# Altium project MGMEZZ04.PrjPCB (part 2 of 3)

## Sheet BuckReg.SchDoc
size Letter; Author: Adam Gilbert; CompanyName: McGill University; DrawnBy: Adam Gilbert; Organization: Altium Limited; Address1: McGill Cosmology; Address2: 3600 University Street; Address3: Montreal, Quebec; Address4: Canada; DocumentNumber: 3; Revision: Rev2; SheetNumber: 3; SheetTotal: 16; ProjectTitle: DfMux FMC Mezz; ModelNumber: MGMEZZ04; ProjectName: DfMux FMC Mezz
Used 2 times, as channels U_FMCPower/BP, U_FMCPower/BN. Parts and nets are listed once, with the designators drawn on the sheet.
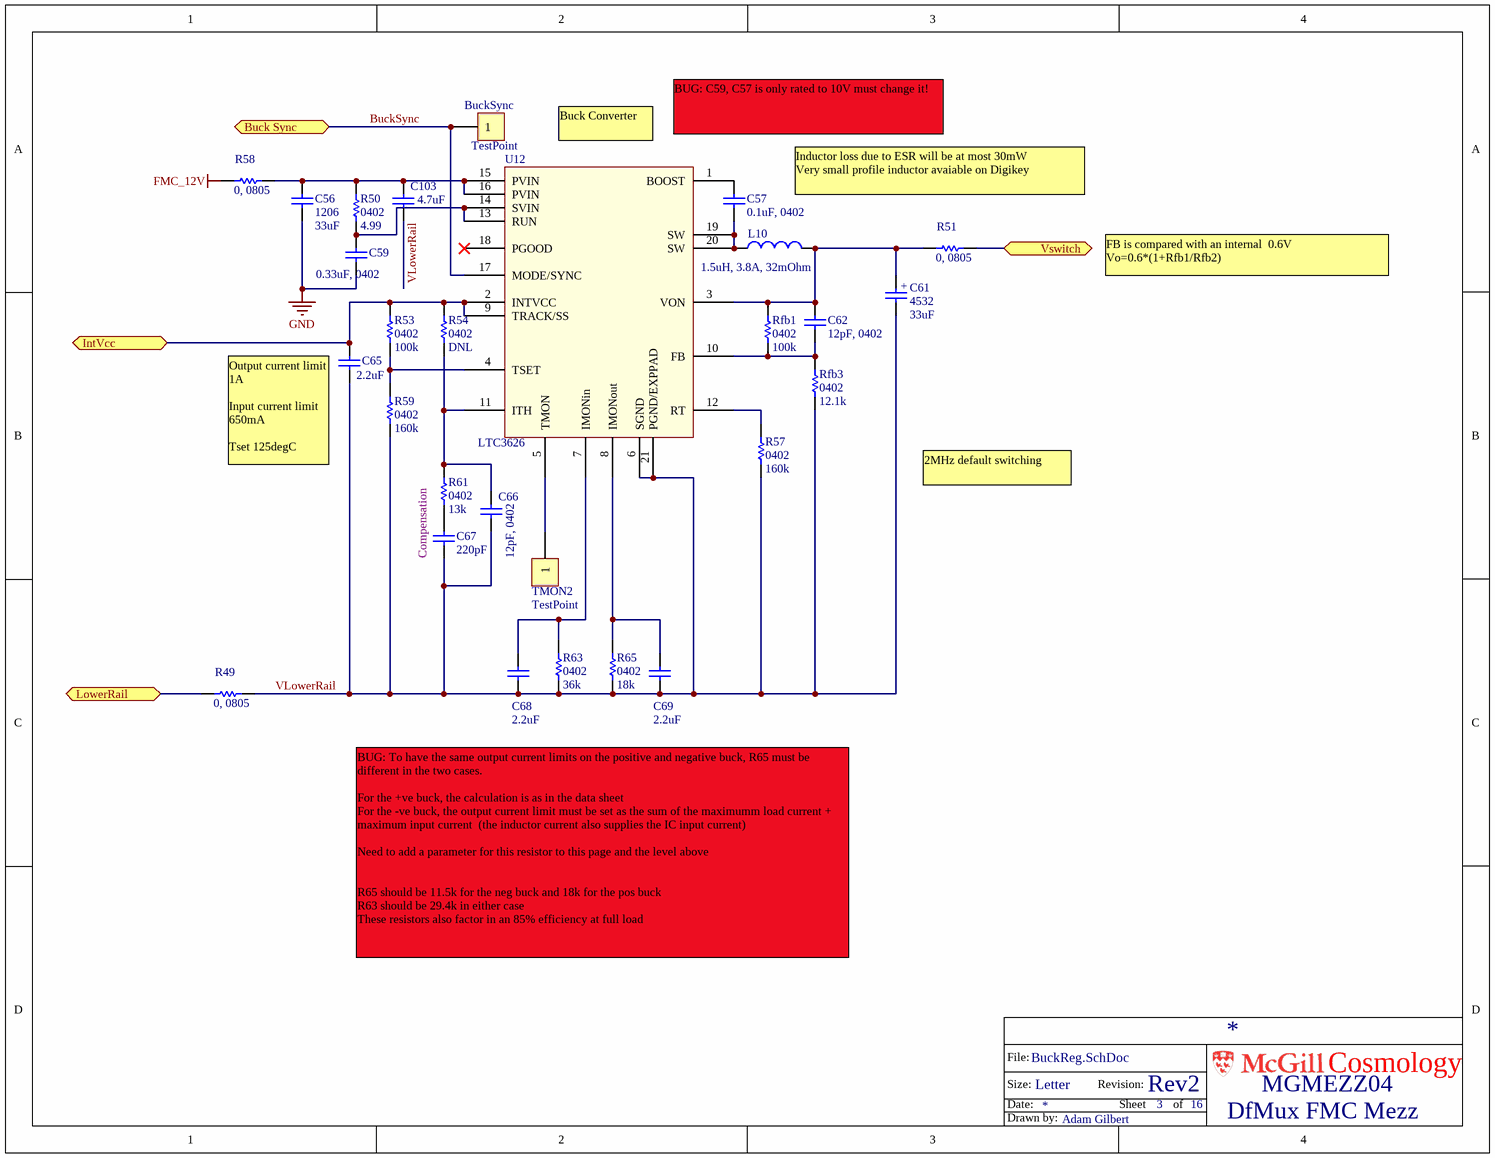
[diagram p6: BuckReg.SchDoc]

### Parts
BuckSync  TestPoint  [TP-3520-SK]  (no BOM)
C56  Footprint: 1206  [CC3225-1210]  (hidden comment: 33uF)
C57  0.1uF, 0402  [0402]
C59  0.33uF, 0402  [0402]
C61  Footprint: 4532  [TANT4532]  (hidden comment: 33uF)
C62  12pF, 0402  [0402]
C65  2.2uF  [0603]
C66  12pF, 0402  [0402]
C67  220pF  [0603]
C68  2.2uF  [0603]
C69  2.2uF  [0603]
C103  4.7uF  [0603]
L10  Part Constraints: 1.5uH, 3.8A, 32mOhm  [IHLP-1212]  (hidden comment: 1.5uH)
R49  0, 0805  [0805]
R50  4.99  [0402]
R51  0, 0805  [0805]
R53  100k  [0402]
R54  DNL  [0402]
R57  160k  [0402]
R58  0, 0805  [0805]
R59  160k  [0402]
R61  13k  [0402]
R63  36k  [0402]
R65  18k  [0402]
Rfb1  100k  [0402]
Rfb3  12.1k  [0402]
TMON2  TestPoint  [TP-3520-SK]  (no BOM)
U12  LTC3626  [LTC3626]

### Ports
Buck Sync, IntVcc, LowerRail, Vswitch

### Nets
FMC_12V: R58.2
GND: C56.2 C59.1
BuckSync: BuckSync.1 U12.17(MODE/SYNC) ; port Buck Sync
IntVcc: C65.2 R53.1 R54.1 U12.2(INTVCC) U12.9(TRACK/SS) ; port IntVcc
LowerRail: R49.2 ; port LowerRail
VLowerRail: C61.2 C65.1 C66.1 C67.2 C68.2 C69.2 C103.2 R49.1 R57.2 R59.2 R63.2 R65.2 Rfb3.2 U12.6(SGND) U12.21(PGND/EXPPAD)
Vswitch: R51.1 ; port Vswitch
NetC56_1: C56.1 C103.1 R50.1 R58.1 U12.15(PVIN) U12.16(PVIN)
NetC57_1: C57.1 L10.1 U12.19(SW) U12.20(SW)
NetC57_2: C57.2 U12.1(BOOST)
NetC59_2: C59.2 R50.2 U12.13(RUN) U12.14(SVIN)
NetC61_1: C61.1 C62.2 L10.2 R51.2 Rfb1.1 U12.3(VON)
NetC62_1: C62.1 Rfb1.2 Rfb3.1 U12.10(FB)
NetC66_2: C66.2 R54.2 R61.1 U12.11(ITH)
NetC67_1: C67.1 R61.2
NetC68_1: C68.1 R63.1 U12.7(IMONin)
NetC69_1: C69.1 R65.1 U12.8(IMONout)
NetR53_2: R53.2 R59.1 U12.4(TSET)
NetR57_1: R57.1 U12.12(RT)
NetTMON2_1: TMON2.1 U12.5(TMON)

Not connected (* = marked no-connect by the designer): U12 18(PGOOD)*

### Channels
U_FMCPower/BP: designators BuckSync=BuckSyncB C56=C56B C57=C57B C59=C59B C61=C61B C62=C62B C65=C65B C66=C66B C67=C67B C68=C68B C69=C69B C103=C103A L10=L10B R49=R49B R50=R50B R51=R51B R53=R53B R54=R54B R57=R57B R58=R58B R59=R59B R61=R61B R63=R63B R65=R65B Rfb1=Rfb1B Rfb3=Rfb3B TMON2=TMON2B U12=U12B; ports Buck Sync=BuckSync IntVcc=NetC65B_2 LowerRail=GND Vswitch=P5V5int
U_FMCPower/BN: designators BuckSync=BuckSyncA C56=C56A C57=C57A C59=C59A C61=C61A C62=C62A C65=C65A C66=C66A C67=C67A C68=C68A C69=C69A C103=C103B L10=L10A R49=R49A R50=R50A R51=R51A R53=R53A R54=R54A R57=R57A R58=R58A R59=R59A R61=R61A R63=R63A R65=R65A Rfb1=Rfb1A Rfb3=Rfb3A TMON2=TMON2A U12=U12A; ports Buck Sync=BuckSyncInv IntVcc=p3v3wrtLowerRail LowerRail=N5V5int Vswitch=GND

### Notes on the sheet
- (near U12) Buck Converter
- BUG: C59, C57 is only rated to 10V must change it!
- Inductor loss due to ESR will be at most 30mW
  Very small profile inductor avaiable on Digikey
- FB is compared with an internal  0.6V
  Vo=0.6*(1+Rfb1/Rfb2)
- (near C65) Output current limit 1A
  Input current limit 650mA
  Tset 125degC
- 2MHz default switching
- Compensation
- BUG: To have the same output current limits on the positive and negative buck, R65 must be different in the two cases.
  For the +ve buck, the calculation is as in the data sheet
  For the -ve buck, the output current limit must be set as the sum of the maximumm load current + maximum input current  (the inductor current also supplies the IC input current)
  Need to add a parameter for this resistor to this page and the level above
  R65 should be 11.5k for the neg buck and 18k for the pos buck
  R63 should be 29.4k in either case
  These resistors also factor in an 85% efficiency at full load
- File:
- Size:
- Date:
- Letter
- Revision:
- Sheet
- of
- Cosmology
- Drawn by:
- (in symbol CAP4532) +

### Library data of the parts
BuckSync TMON2 = TestPoint: TestPoint1; Assembly Comments: none; Footprint: *
C56 = CAP 1210: Capacitor, Ceramic, 1210; Manufacturer: TDK Corporation; Part Constraints: 33uF or 47uF  (1206 or 1210) 25V X5R; Manufacturer Part Number 1: C3216X5R1E336M; Assembly Comments: none; Temperature Coefficient: X5R; Value: 33uF; Supplier 1: Digi-Key; Supplier Part Number 1: 445-8046-1-ND; Operating Temperature: -55°C ~ 85°C; Packaging: Cut Tape (CT)
C57 = CAP 0603: as C58 on sheet MGMEZZ04; Value: 0.1uF, 0402; Supplier 1: Digi-Key; Supplier Part Number 1: 445-1265-1-ND; Operating Temperature: -55°C ~ 85°C; Thickness (Max): 0.022" (0.55mm); Packaging: Cut Tape (CT)
C59 = CAP 0603: Capacitor, Ceramic, 0402; Part Constraints: 10% 10V X5R 0402; Manufacturer: TDK Corporation; Manufacturer Part Number 1: C1005X5R1A334K050BB; Temperature Coefficient: X5R; Assembly Comments: none; Value: 0.33uF, 0402; Operating Temperature: -55°C ~ 85°C; Thickness (Max): 0.022" (0.55mm); Packaging: Cut Tape (CT); Supplier 1: Digi-Key; Supplier Part Number 1: 445-4987-6-ND
C61 = CAP4532: 33u, 16V, 20%, 4532C, X5R; Manufacturer: TDK Corporation; Manufacturer Part Number 1: C4532X5R1C336M; Assembly Comments: none; Part Constraints: 33u, 16V, 20%, 4532C, X5R; Supplier 1: Digi-Key; Supplier Part Number 1: 445-1443-1-ND; Value: 33uF; Operating Temperature: -55°C ~ 85°C; Packaging: Cut Tape (CT); Temperature Coefficient: X5R
C62 C66 = CAP 0402: Capacitor, Ceramic, 0402; Part Constraints: 10% 16V X7R 0402; Manufacturer: Generic; Assembly Comments: none; Value: 12pF, 0402; Manufacturer Part Number 1: Generic
C65 = CAP 0603: Capacitor, Ceramic, 0603; Part Constraints: 10% 10V X5R 0603; Manufacturer: Generic; Assembly Comments: none; Value: 2.2uF; Manufacturer Part Number 1: Generic
C67 = CAP 0603: Capacitor, Ceramic, 0603; Part Constraints: 10% 16V X7R 0603; Manufacturer: Generic; Assembly Comments: none; Value: 220pF; Manufacturer Part Number 1: Generic
C68 C69 = CAP 0603: Capacitor, Ceramic, 0603; Part Constraints: 10% 6.3V X5R 0603; Manufacturer: TDK Corporation; Manufacturer Part Number 1: C1608X5R0J225K080AB; Assembly Comments: none; Temperature Coefficient: X5R; Value: 2.2uF; Supplier 1: Digi-Key; Supplier Part Number 1: 445-5175-1-ND; Operating Temperature: -55°C ~ 85°C; Thickness (Max): 0.037" (0.95mm); Packaging: Cut Tape (CT)
C103 = CAP 0603: Capacitor, Ceramic, 0603; Part Constraints: 10% 35V X5R 0603; Manufacturer: Murata Electronics North America; Manufacturer Part Number 1: GRM188R6YA475KE15D; Assembly Comments: none; Value: 4.7uF
L10 = IND IHLP1212: Inductor IHLP1212; Manufacturer: Vishay Dale; Manufacturer Part Number 1: IHLP1212BZER1R5M11; Assembly Comments: none; Footprint: IHLP1212; Value: 1.5uH; Supplier 1: Digi-Key; Supplier Part Number 1: 541-1321-1-ND
R49 R51 R58 = Res1812: RES 0.0 OHM 1/8W 0805 SMD; Manufacturer: e.g Vishay/Dale; Part constraints: 0Ohm jumper, >=4A, 0805, <=5mOhms; Manufacturer Part Number 1: e.g CRCW08050000Z0EAHP; Value: 0; Assembly Comments: none; Supplier 1: Newark; Supplier Part Number 1: 68R2993
R50 R53 R54 R57 R59 R61 R63 R65 Rfb1 Rfb3 = RES 0402: as R56 on sheet MGMEZZ04; Manufacturer Part Number 1: Generic
  R50: Value: 4.99
  R53 Rfb1: Value: 100k
  R54: Value: DNL
  R57 R59: Value: 160k
  R61: Value: 13k
  R63: Value: 36k
  R65: Value: 18k
  Rfb3: Value: 12.1k
U12 = LTC3626: 20V, 2.5A Sync buck, 3Mhz; Part Constraints: LTC3626EUDC#PBF; Manufacturer: Linear Technology; Assembly Comments: none; Supplier 1: Digi-Key; Supplier Part Number 1: LTC3626EUDC#PBF-ND; Manufacturer Part Number 1: LTC3626EUDC#PBF

## Sheet TwoWires.SchDoc
size Letter; Author: Adam Gilbert; CompanyName: McGill University; DrawnBy: Adam Gilbert; Organization: Altium Limited; Address1: McGill Cosmology; Address2: 3600 University Street; Address3: Montreal, Quebec; Address4: Canada; DocumentNumber: 4; Revision: Rev2; SheetNumber: 4; SheetTotal: 16; ProjectTitle: DfMux FMC Mezz; ModelNumber: MGMEZZ04; ProjectName: DfMux FMC Mezz
Used 2 times, as channels W12, W34. Parts and nets are listed once, with the designators drawn on the sheet.
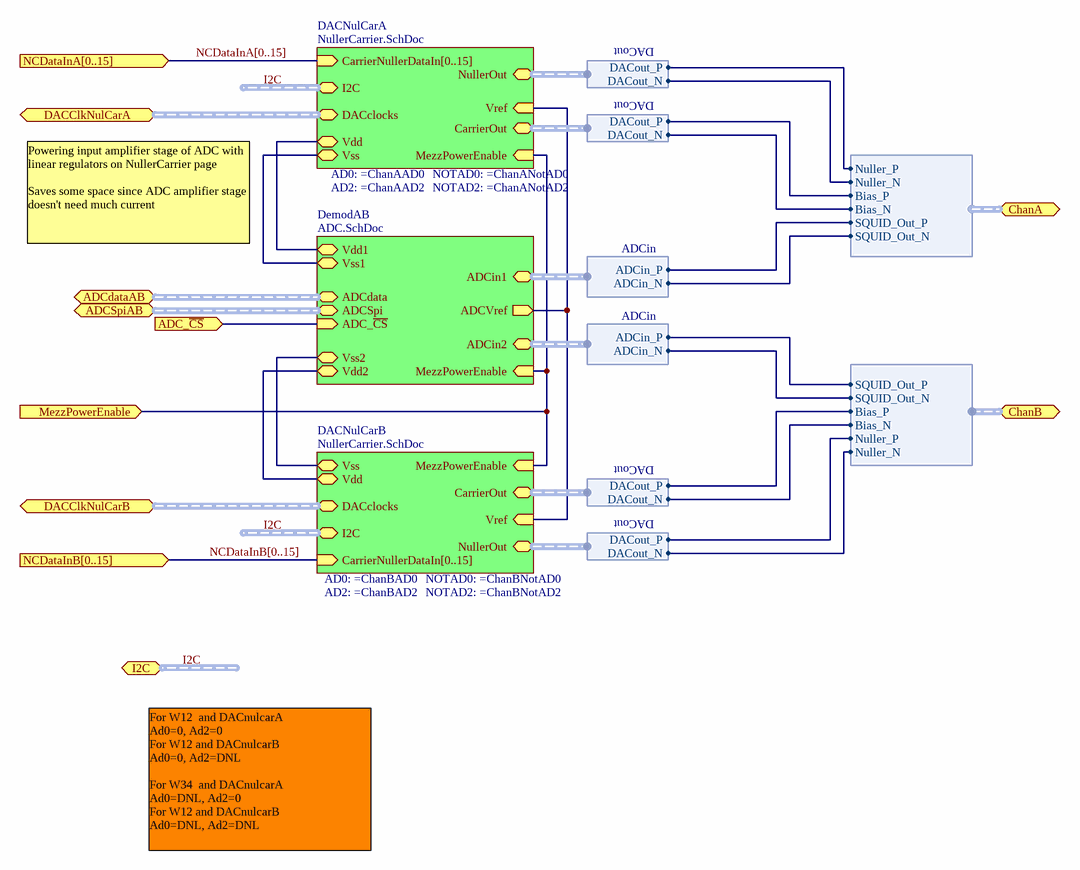
[diagram p7: TwoWires.SchDoc]

### Sub-sheets
DACNulCarA = NullerCarrier.SchDoc: NullerOut (harness DACout), CarrierOut (harness DACout), DACclocks (harness DACclks), Vdd, Vss, CarrierNullerDataIn[0..15] (in), I2C (harness I2C), MezzPowerEnable (in), Vref (in)  | NOTAD0: =ChanANotAD0; NOTAD2: =ChanANotAD2; AD0: =ChanAAD0; AD2: =ChanAAD2
DACNulCarB = NullerCarrier.SchDoc: NullerOut (harness DACout), CarrierOut (harness DACout), DACclocks (harness DACclks), Vdd, Vss, CarrierNullerDataIn[0..15] (in), I2C (harness I2C), MezzPowerEnable (in), Vref (in)  | NOTAD0: =ChanBNotAD0; NOTAD2: =ChanBNotAD2; AD0: =ChanBAD0; AD2: =ChanBAD2
DemodAB = ADC.SchDoc: ADCin1 (harness ADCin), ADCin2 (harness ADCin), ADCSpi (harness ADCSPI), ADCdata (harness ADCData), Vdd1, Vss1, Vdd2, Vss2, ADC_~{CS} (in), MezzPowerEnable (in), ADCVref (out)

### Ports
ADC_~{CS} (in), ADCdataAB (harness ADCData), ADCSpiAB (harness ADCSPI), ChanA (harness SQUID_CH_OUT), ChanB (harness SQUID_CH_OUT), DACClkNulCarA (harness DACclks), DACClkNulCarB (harness DACclks), I2C (harness I2C), MezzPowerEnable (in), NCDataInA[0..15] (in), NCDataInB[0..15] (in)

### Harnesses
DACout: DACout_N, DACout_P
SQUID_CH_OUT: Bias_P, Bias_N, Nuller_P, Nuller_N, SQUID_Out_P, SQUID_Out_N
ADCin: ADCin_P, ADCin_N

### Nets
ADC_~{CS}: port ADC_~{CS}, sheet DemodAB/ADC_~{CS}
MezzPowerEnable: port MezzPowerEnable, sheet DACNulCarA/MezzPowerEnable, sheet DemodAB/MezzPowerEnable, sheet DACNulCarB/MezzPowerEnable
(unnamed): sheet DACNulCarA/Vdd, sheet DemodAB/Vdd1
(unnamed): sheet DACNulCarA/Vss, sheet DemodAB/Vss1
(unnamed): sheet DACNulCarA/Vref, sheet DemodAB/ADCVref, sheet DACNulCarB/Vref
(unnamed): sheet DemodAB/Vdd2, sheet DACNulCarB/Vdd
(unnamed): sheet DemodAB/Vss2, sheet DACNulCarB/Vss
(unnamed): sheet DACNulCarA/NullerOut.DACout_N, port ChanA.Nuller_N
(unnamed): sheet DACNulCarA/NullerOut.DACout_P, port ChanA.Nuller_P
(unnamed): sheet DACNulCarA/CarrierOut.DACout_N, port ChanA.Bias_N
(unnamed): sheet DACNulCarA/CarrierOut.DACout_P, port ChanA.Bias_P
(unnamed): sheet DACNulCarB/CarrierOut.DACout_N, port ChanB.Bias_N
(unnamed): sheet DACNulCarB/CarrierOut.DACout_P, port ChanB.Bias_P
(unnamed): sheet DACNulCarB/NullerOut.DACout_N, port ChanB.Nuller_N
(unnamed): sheet DACNulCarB/NullerOut.DACout_P, port ChanB.Nuller_P
(unnamed): port ChanA.SQUID_Out_P, sheet DemodAB/ADCin1.ADCin_P
(unnamed): port ChanA.SQUID_Out_N, sheet DemodAB/ADCin1.ADCin_N
(unnamed): sheet DemodAB/ADCin2.ADCin_P, port ChanB.SQUID_Out_P
(unnamed): sheet DemodAB/ADCin2.ADCin_N, port ChanB.SQUID_Out_N

### Channels
W12: ports ADC_~{CS}=ADC_CS_Wire1 MezzPowerEnable=MezzPowerEnable
W34: ports ADC_~{CS}=ADC_CS_Wire2 MezzPowerEnable=MezzPowerEnable

### Buses and harness runs
bus NCDataInA[0..15] = port NCDataInA[0..15] = sheet DACNulCarA/CarrierNullerDataIn[0..15]
bus NCDataInB[0..15] = port NCDataInB[0..15] = sheet DACNulCarB/CarrierNullerDataIn[0..15]
harness I2C = port I2C
harness I2C = sheet DACNulCarA/I2C
harness I2C = sheet DACNulCarB/I2C
harness port ADCdataAB = sheet DemodAB/ADCdata
harness port ADCSpiAB = sheet DemodAB/ADCSpi
harness port DACClkNulCarA = sheet DACNulCarA/DACclocks
harness port DACClkNulCarB = sheet DACNulCarB/DACclocks

### Notes on the sheet
- Powering input amplifier stage of ADC with linear regulators on NullerCarrier page
  Saves some space since ADC amplifier stage doesn't need much current
- For W12  and DACnulcarA
  Ad0=0, Ad2=0
  For W12 and DACnulcarB
  Ad0=0, Ad2=DNL
  For W34  and DACnulcarA
  Ad0=DNL, Ad2=0
  For W12 and DACnulcarB
  Ad0=DNL, Ad2=DNL
- File:
- Size:
- Date:
- Letter
- Revision:
- Sheet
- of
- Cosmology
- Drawn by:

## Sheet NullerCarrier.SchDoc
size Letter; Author: Adam Gilbert; CompanyName: McGill University; DrawnBy: Adam Gilbert; Organization: Altium Limited; Address1: McGill Cosmology; Address2: 3600 University Street; Address3: Montreal, Quebec; Address4: Canada; DocumentNumber: 6; Revision: Rev2; SheetNumber: 6; SheetTotal: 16; ProjectTitle: DfMux FMC Mezz; ModelNumber: MGMEZZ04; ProjectName: DfMux FMC Mezz
Used 4 times, as channels W12/DACNulCarA, W12/DACNulCarB, W34/DACNulCarA, W34/DACNulCarB. Parts and nets are listed once, with the designators drawn on the sheet.
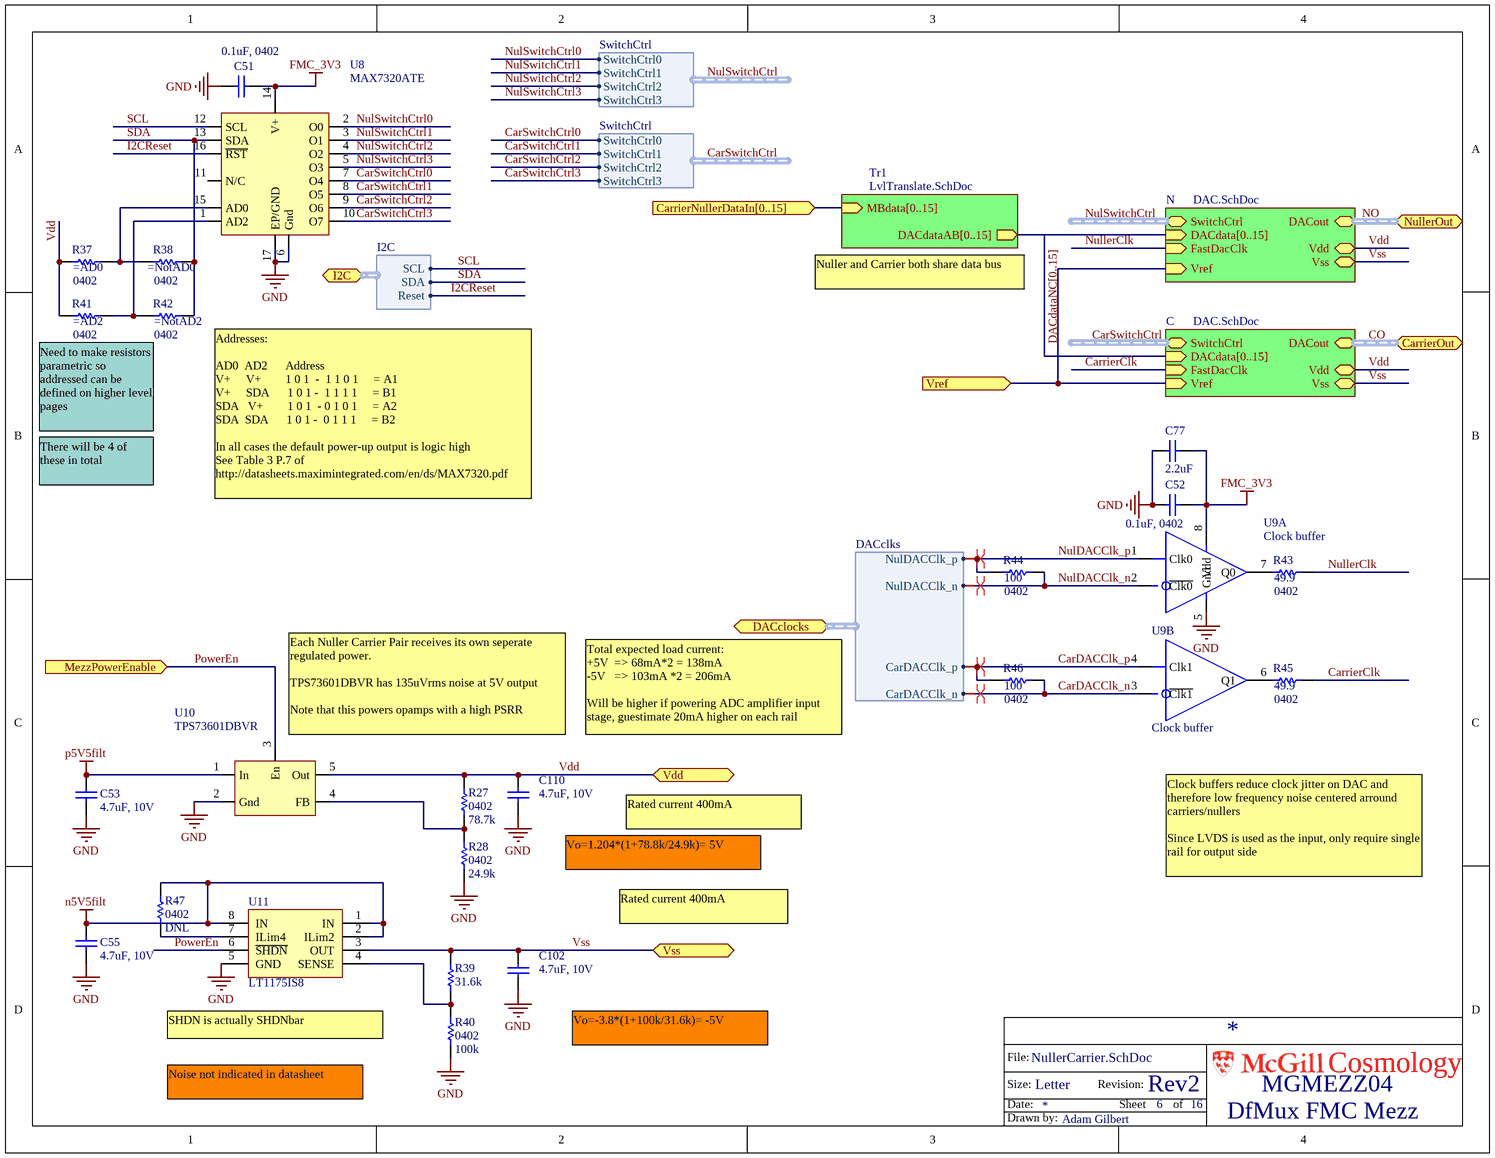
[diagram p8: NullerCarrier.SchDoc]

### Parts
C51  0.1uF, 0402  [0402]
C52  0.1uF, 0402  [0402]
C53  4.7uF, 10V  [0805]
C55  4.7uF, 10V  [0805]
C77  2.2uF  [0603]
C102  4.7uF, 10V  [0805]
C110  4.7uF, 10V  [0805]
R27  78.7k  [0402]
R28  24.9k  [0402]
R37  (no value)  [0402]
R38  (no value)  [0402]
R39  31.6k  [0603]
R40  100k  [0402]
R41  (no value)  [0402]
R42  (no value)  [0402]
R43  49.9  [0402]
R44  100  [0402]
R45  49.9  [0402]
R46  100  [0402]
R47  DNL  [0402]
U8  MAX7320ATE  [QFN127P600-8N-MAX7319]
U9  Clock buffer  [SO8]  (parts A,B of 2)
U10  TPS73601DBVR  [SOT23-5]
U11  LT1175IS8  [SO8]

### Sub-sheets
C = DAC.SchDoc: DACout (harness DACout), SwitchCtrl (harness SwitchCtrl), DACdata[0..15] (in), FastDacClk (in), Vdd, Vss, Vref (in)
N = DAC.SchDoc: DACout (harness DACout), SwitchCtrl (harness SwitchCtrl), DACdata[0..15] (in), FastDacClk (in), Vdd, Vss, Vref (in)
Tr1 = LvlTranslate.SchDoc: DACdataAB[0..15] (out), MBdata[0..15] (in)

### Ports
CarrierNullerDataIn[0..15] (in), CarrierOut (harness DACout), DACclocks (harness DACclks), I2C (harness I2C), MezzPowerEnable (in), NullerOut (harness DACout), Vdd, Vref (in), Vss

### Harnesses
SwitchCtrl: SwitchCtrl0, SwitchCtrl1, SwitchCtrl2, SwitchCtrl3
DACclks: NulDACClk_p, NulDACClk_n, CarDACClk_p, CarDACClk_n
I2C: SCL, SDA, Reset

### Nets
FMC_3V3: C51.2 C52.1 C77.2 U8.14(V+) U9.8(Vdd)
GND: C51.1 C52.2 C53.1 C55.1 C77.1 C102.1 C110.1 R28.1 R40.1 U8.6(Gnd) U8.17(EP/GND) U9.5(Gnd) U10.2(Gnd) U11.5(GND)
n5V5filt: C55.2 R47.2 U11.1(IN) U11.2(ILim2) U11.8(IN)
p5V5filt: C53.2 U10.1(In)
CarDACClk_n: R46.2 U9.3(~{Clk1}) ; port DACclocks.CarDACClk_n
CarDACClk_p: R46.1 U9.4(Clk1) ; port DACclocks.CarDACClk_p
CarrierClk: R45.2 ; sheet C/FastDacClk
CarSwitchCtrl0: U8.7(O4) ; sheet C/SwitchCtrl.SwitchCtrl0  [project net CarSwitchCtrl.SwitchCtrl0]
CarSwitchCtrl1: U8.8(O5) ; sheet C/SwitchCtrl.SwitchCtrl1  [project net CarSwitchCtrl.SwitchCtrl1]
CarSwitchCtrl2: U8.9(O6) ; sheet C/SwitchCtrl.SwitchCtrl2  [project net CarSwitchCtrl.SwitchCtrl2]
CarSwitchCtrl3: U8.10(O7) ; sheet C/SwitchCtrl.SwitchCtrl3  [project net CarSwitchCtrl.SwitchCtrl3]
I2CReset: U8.16(~{RST}) ; port I2C.Reset
NulDACClk_n: R44.2 U9.2(~{Clk0}) ; port DACclocks.NulDACClk_n
NulDACClk_p: R44.1 U9.1(Clk0) ; port DACclocks.NulDACClk_p
NullerClk: R43.2 ; sheet N/FastDacClk
NulSwitchCtrl0: U8.2(O0) ; sheet N/SwitchCtrl.SwitchCtrl0  [project net NulSwitchCtrl.SwitchCtrl0]
NulSwitchCtrl1: U8.3(O1) ; sheet N/SwitchCtrl.SwitchCtrl1  [project net NulSwitchCtrl.SwitchCtrl1]
NulSwitchCtrl2: U8.4(O2) ; sheet N/SwitchCtrl.SwitchCtrl2  [project net NulSwitchCtrl.SwitchCtrl2]
NulSwitchCtrl3: U8.5(O3) ; sheet N/SwitchCtrl.SwitchCtrl3  [project net NulSwitchCtrl.SwitchCtrl3]
PowerEn: U10.3(En) U11.6(~{SHDN}) ; port MezzPowerEnable
SCL: U8.12(SCL) ; port I2C.SCL
SDA: R38.2 R42.2 U8.13(SDA) ; port I2C.SDA
Vdd: C110.2 R27.2 R37.1 R41.1 U10.5(Out) ; port Vdd, sheet N/Vdd, sheet C/Vdd
Vref: port Vref, sheet N/Vref, sheet C/Vref
Vss: C102.2 R39.1 U11.3(OUT) ; port Vss, sheet N/Vss, sheet C/Vss
NetR27_1: R27.1 R28.2 U10.4(FB)
NetR37_2: R37.2 R38.1 U8.15(AD0)
NetR39_2: R39.2 R40.2 U11.4(SENSE)
NetR41_2: R41.2 R42.1 U8.1(AD2)
NetR43_1: R43.1 U9.7(Q0)
NetR45_1: R45.1 U9.6(Q1)
NetR47_1: R47.1 U11.7(ILim4)

Not connected (* = marked no-connect by the designer): U8 11(N/C)

### Channels
W12/DACNulCarA: designators end in A; ports MezzPowerEnable=MezzPowerEnable Vdd=Vdd Vref=Vref Vss=Vss
W12/DACNulCarB: designators end in B; ports MezzPowerEnable=MezzPowerEnable Vdd=Vdd Vref=Vref Vss=Vss
W34/DACNulCarA: designators end in C; ports MezzPowerEnable=MezzPowerEnable Vdd=Vdd Vref=Vref Vss=Vss
W34/DACNulCarB: designators end in D; ports MezzPowerEnable=MezzPowerEnable Vdd=Vdd Vref=Vref Vss=Vss

### Buses and harness runs
bus DACdataNC[0..15] = sheet C/DACdata[0..15] = sheet N/DACdata[0..15] = sheet Tr1/DACdataAB[0..15]
bus port CarrierNullerDataIn[0..15] = sheet Tr1/MBdata[0..15]
harness CarSwitchCtrl = sheet C/SwitchCtrl
harness CO = port CarrierOut = sheet C/DACout
harness NO = port NullerOut = sheet N/DACout
harness NulSwitchCtrl = sheet N/SwitchCtrl

### Layout directives
differential pair: CH1_DAC_CLK.CarDACClk_n, CH1_DAC_CLK.CarDACClk_p, CH1_DAC_CLK.NulDACClk_n, CH1_DAC_CLK.NulDACClk_p

### Notes on the sheet
- Nuller and Carrier both share data bus
- Need to make resistors parametric so addressed can be defined on higher level pages
- There will be 4 of these in total
- (near R42) Addresses:
  AD0  AD2      Address
  V+     V+        1 0 1  -  1 1 0 1     = A1
  V+     SDA      1 0 1 -  1 1 1 1     = B1
  SDA   V+        1 0 1  - 0 1 0 1     = A2
  SDA  SDA      1 0 1 -  0 1 1 1     = B2
  In all cases the default power-up output is logic high
  See Table 3 P.7 of http://datasheets.maximintegrated.com/en/ds/MAX7320.pdf
- (near U10) Each Nuller Carrier Pair receives its own seperate regulated power.
  TPS73601DBVR has 135uVrms noise at 5V output
  Note that this powers opamps with a high PSRR
- Total expected load current:
  +5V  => 68mA*2 = 138mA
  -5V   => 103mA *2 = 206mA
  Will be higher if powering ADC amplifier input stage, guestimate 20mA higher on each rail
- Rated current 400mA
- Vo=1.204*(1+78.8k/24.9k)= 5V
- Clock buffers reduce clock jitter on DAC and therefore low frequency noise centered arround carriers/nullers
  Since LVDS is used as the input, only require single rail for output side
- SHDN is actually SHDNbar
- Vo=-3.8*(1+100k/31.6k)= -5V
- Noise not indicated in datasheet
- File:
- Size:
- Date:
- Letter
- Revision:
- Sheet
- of
- Cosmology
- Drawn by:

### Library data of the parts
C51 C52 = CAP 0603: Capacitor, Ceramic, 0402; Part Constraints: 10% 10V X5R 0402; Manufacturer: TDK Corporation; Manufacturer Part Number 1: C1005X5R1A104K050BA; Temperature Coefficient: X5R; Assembly Comments: none; Value: 0.1uF, 0402; Supplier 1: Digi-Key; Supplier Part Number 1: 445-1265-1-ND; Operating Temperature: -55°C ~ 85°C; Thickness (Max): 0.022" (0.55mm); Packaging: Cut Tape (CT)
C53 C55 C102 C110 = CAP 0805: Capacitor, Ceramic, 0805; Manufacturer Part Number 1: LMK212BJ475KD-T; Manufacturer: Taiyo Yuden; Temperature Coefficient: X5R; Assembly Comments: none; Supplier 1: Digi-Key; Supplier Part Number 1: 587-1297-6-ND; Packaging: Digi-Reel®; Operating Temperature: -55°C ~ 85°C; Thickness (Max): 0.037" (0.95mm); Value: 4.7uF, 10V; Part Constraints: LMK212BJ475KD-T
C77 = CAP 0603: Capacitor, Ceramic, 0603; Part Constraints: 10% 6.3V X5R 0603; Manufacturer: TDK Corporation; Manufacturer Part Number 1: C1608X5R0J225K080AB; Assembly Comments: none; Temperature Coefficient: X5R; Value: 2.2uF; Supplier 1: Digi-Key; Supplier Part Number 1: 445-5175-1-ND; Operating Temperature: -55°C ~ 85°C; Thickness (Max): 0.037" (0.95mm); Packaging: Cut Tape (CT)
R27 R28 R37 R38 R40-R47 = RES 0402: Resistor; Manufacturer: Generic; Part Constraints: 1% 1/10W 100ppm 0402; Assembly Comments: none; Manufacturer Part Number 1: Generic
  R27: Value: 78.7k
  R28: Value: 24.9k
  R37: Value: =AD0
  R38: Value: =NotAD0
  R40: Value: 100k
  R41: Value: =AD2
  R42: Value: =NotAD2
  R43 R45: Value: 49.9
  R44 R46: Value: 100
  R47: Value: DNL
R39 = RES 0603: Resistor; Manufacturer: Generic; Part Constraints: 1% 1/10W 100ppm 0603; Assembly Comments: none; Value: 31.6k; Manufacturer Part Number 1: Generic
U8 = MAX7320ATE: IO expander 8bit I2C; Manufacturer Part Number 1: MAX7320ATE+; Manufacturer: Maxim Integrated; Assembly Comments: none; Supplier 1: Digi-Key; Packaging: Tube; Operating Temperature: -40°C ~ 125°C; Supplier Part Number 1: MAX7320ATE+-ND; Part Constraints: MAX7320ATE+
U9 = ICS83023AMILF: IC CLK TRANSLTR 1:1 350MHZ 8SOIC; Manufacturer: IDT, Integrated Device Technology Inc; Assembly Comments: none; Supplier 1: Digi-Key; Manufacturer Part Number 1: ICS83023AMILF; Operating Temperature: -40°C ~ 85°C; Packaging: Tube; Supplier Part Number 1: 800-1102-5-ND; Part Constraints: ICS83023AMILF
U10 = TPS73601DBVR: Adjustable 30uVrms noise 400mA regulator; Manufacturer Part Number 1: TPS73601DBVT; Manufacturer: Texas Instruments; Assembly Comments: none; Supplier 1: Digi-Key; Operating Temperature: -40°C ~ 125°C; Packaging: Cut Tape (CT); Supplier Part Number 1: 296-15814-1-ND; Part Constraints: TPS73601DBVT
U11 = LT1175IS8: REG, negative micropower low dropout; Manufacturer: Linear Technology; Manufacturer Part Number 1: LT1175IS8#PBF; Assembly Comments: none; Part Constraints: LT1175IS8; Supplier 1: Digi-Key; Supplier Part Number 1: LT1175IS8#PBF-ND

## Sheet DAC.SchDoc
size Letter; PageSetup: Record=PageOptions|CenterHorizontal=True|CenterVertical=True|PrintScale=0.75|XCorrection=1.00|YCorrection=1.00|PrintKind=1|BorderSize=5000000|LeftOffset=0|BottomOffset=0|Orientation=2|PaperLength=1000|PaperWidth=1000|Scale=100|PaperSource=7|PrintQuality=-4|MediaType=1|DitherType=10|PaperKind=Letter|PrintScaleMode=1; Author: Adam Gilbert; CompanyName: McGill University; DrawnBy: Adam Gilbert; Organization: Altium Limited; Address1: McGill Cosmology; Address2: 3600 University Street; Address3: Montreal, Quebec; Address4: Canada; DocumentNumber: 7; Revision: Rev2; SheetNumber: 7; SheetTotal: 16; ProjectTitle: DfMux FMC Mezz; ModelNumber: MGMEZZ04; ProjectName: DfMux FMC Mezz
Used 8 times, as channels W12/DACNulCarA/N, W12/DACNulCarA/C, W12/DACNulCarB/N, W12/DACNulCarB/C, W34/DACNulCarA/N, W34/DACNulCarA/C, W34/DACNulCarB/N, W34/DACNulCarB/C. Parts and nets are listed once, with the designators drawn on the sheet.
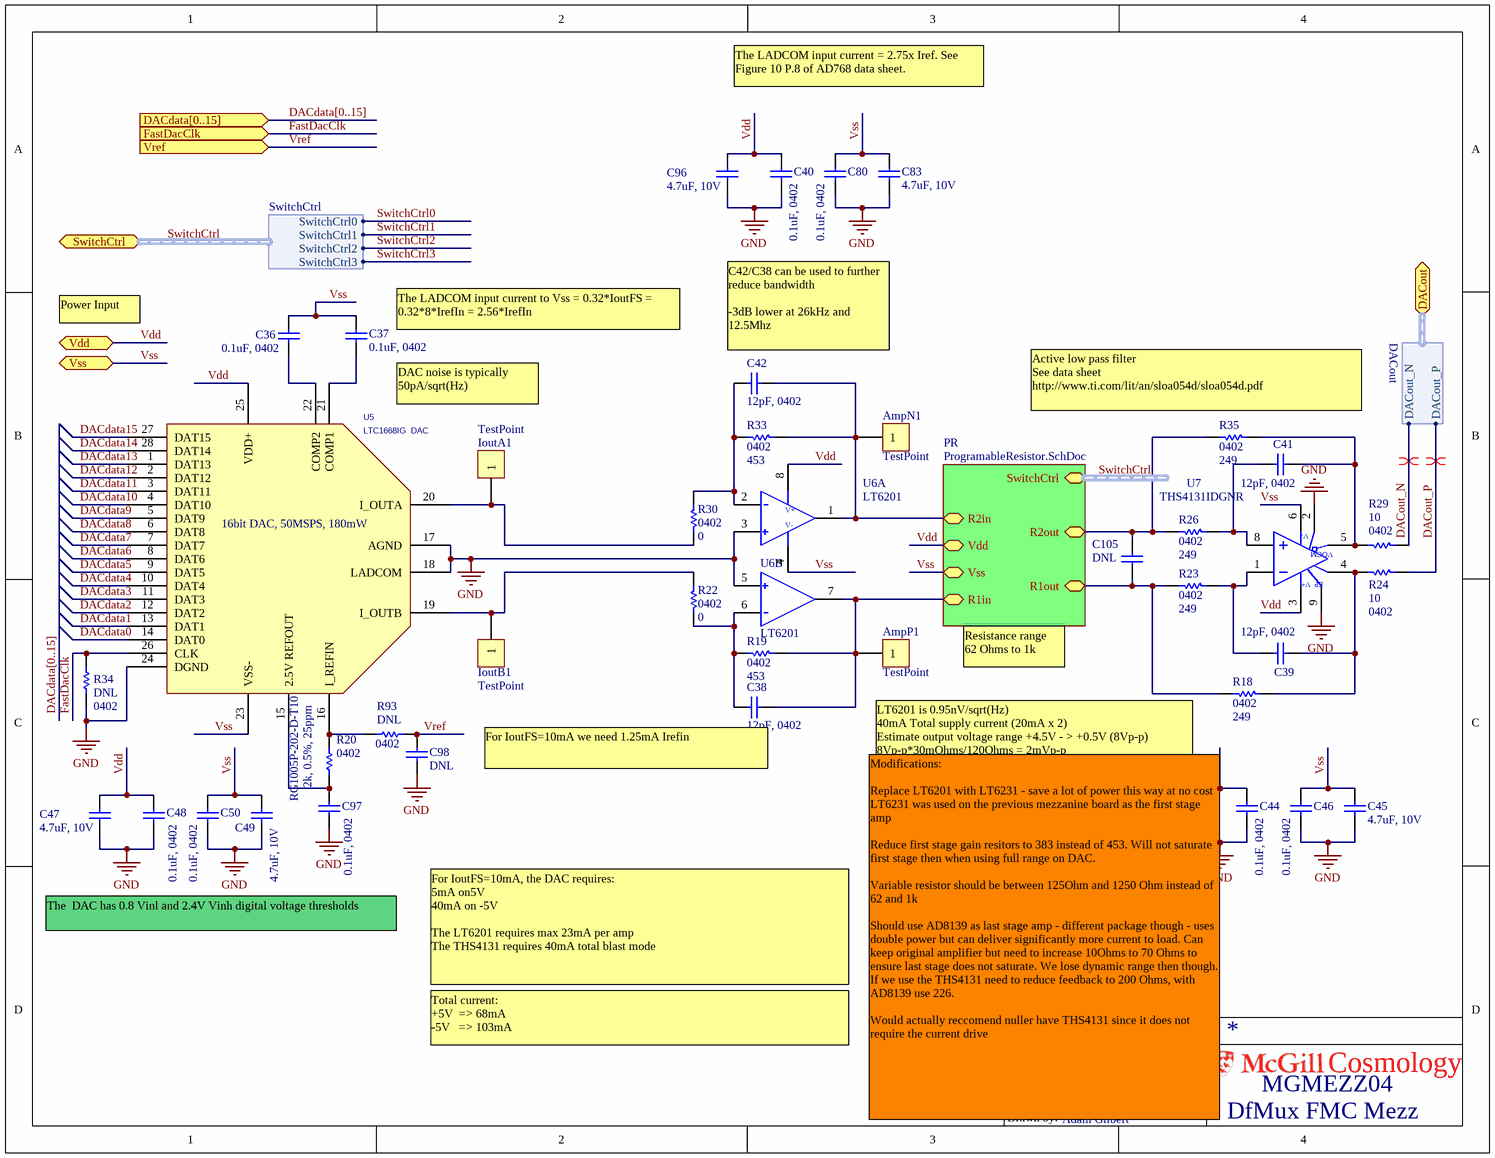
[diagram p9: DAC.SchDoc]

### Parts
AmpN1  TestPoint  [TP-3520-SK]  (no BOM)
AmpP1  TestPoint  [TP-3520-SK]  (no BOM)
C36  0.1uF, 0402  [0402]
C37  0.1uF, 0402  [0402]
C38  12pF, 0402  [0402]
C39  12pF, 0402  [0402]
C40  0.1uF, 0402  [0402]
C41  12pF, 0402  [0402]
C42  12pF, 0402  [0402]
C43  4.7uF, 10V  [0805]
C44  0.1uF, 0402  [0402]
C45  4.7uF, 10V  [0805]
C46  0.1uF, 0402  [0402]
C47  4.7uF, 10V  [0805]
C48  0.1uF, 0402  [0402]
C49  4.7uF, 10V  [0805]
C50  0.1uF, 0402  [0402]
C80  0.1uF, 0402  [0402]
C83  4.7uF, 10V  [0805]
C96  4.7uF, 10V  [0805]
C97  0.1uF, 0402  [0402]
C98  DNL  [0805]
C105  DNL  [0402]
IoutA1  TestPoint  [TP-3520-SK]  (no BOM)
IoutB1  TestPoint  [TP-3520-SK]  (no BOM)
R18  249  [0402]
R19  453  [0402]
R20  Manufacturer Part Number 1: RG1005P-202-D-T10  [0402]  (hidden comment: 2k, 0.5%, 25ppm)
R22  0  [0402]
R23  249  [0402]
R24  10  [0402]
R26  249  [0402]
R29  10  [0402]
R30  0  [0402]
R33  453  [0402]
R34  DNL  [0402]
R35  249  [0402]
R93  DNL  [0402]
U5  LTC1668IG  DAC  [SOG.65M/28/WG8.20/L10.16]
U6  LT6201  [SO8]  (parts A,B of 2)
U7  THS4131IDGNR  [SOP8-EP-127P600-8N]

### Sub-sheets
PR = ProgramableResistor.SchDoc: R1in, R2in, R1out, R2out, Vdd, Vss, SwitchCtrl (harness SwitchCtrl)

### Ports
DACdata[0..15] (in), DACout (harness DACout), FastDacClk (in), SwitchCtrl (harness SwitchCtrl), Vdd, Vref (in), Vss

### Harnesses
DACout: DACout_N, DACout_P
SwitchCtrl: SwitchCtrl0, SwitchCtrl1, SwitchCtrl2, SwitchCtrl3

### Nets
GND: C40.1 C43.1 C44.1 C45.1 C46.1 C47.1 C48.1 C49.1 C50.1 C80.1 C83.1 C96.1 C97.1 C98.1 R34.1 U5.17(AGND) U5.18(LADCOM) U5.24(DGND) U6.3(IN+) U6.5(IN+) U7.2(VOCM) U7.9(EP)
DACdata0: U5.14(DAT0)
DACdata1: U5.13(DAT1)
DACdata2: U5.12(DAT2)
DACdata3: U5.11(DAT3)
DACdata4: U5.10(DAT4)
DACdata5: U5.9(DAT5)
DACdata6: U5.8(DAT6)
DACdata7: U5.7(DAT7)
DACdata8: U5.6(DAT8)
DACdata9: U5.5(DAT9)
DACdata10: U5.4(DAT10)
DACdata11: U5.3(DAT11)
DACdata12: U5.2(DAT12)
DACdata13: U5.1(DAT13)
DACdata14: U5.28(DAT14)
DACdata15: U5.27(DAT15)
DACout_N: R29.2 ; port DACout.DACout_N
DACout_P: R24.2 ; port DACout.DACout_P
FastDacClk: R34.2 U5.26(CLK) ; port FastDacClk
Vdd: C40.2 C43.2 C44.2 C47.2 C48.2 C96.2 U5.25(VDD+) U6.8(V+) U7.3(V+) ; port Vdd, sheet PR/Vdd
Vref: C98.2 R93.1 ; port Vref
Vss: C36.2 C37.2 C45.2 C46.2 C49.2 C50.2 C80.2 C83.2 U5.23(VSS-) U6.4(V-) U7.6(V-) ; port Vss, sheet PR/Vss
NetAmpN1_1: AmpN1.1 C42.1 R33.2 U6.1(Out) ; sheet PR/R2in
NetAmpP1_1: AmpP1.1 C38.1 R19.2 U6.7(Out) ; sheet PR/R1in
NetC36_1: C36.1 U5.22(COMP2)
NetC37_1: C37.1 U5.21(COMP1)
NetC38_2: C38.2 R19.1 R22.1 U6.6(IN-)
NetC39_1: C39.1 R18.2 R24.1 U7.4(OUT+)
NetC39_2: C39.2 R23.2 U7.1(IN-)
NetC41_1: C41.1 R29.1 R35.2 U7.5(OUT-)
NetC41_2: C41.2 R26.2 U7.8(IN+)
NetC42_2: C42.2 R30.2 R33.1 U6.2(IN-)
NetC97_2: C97.2 R20.1 U5.15(2.5V_REFOUT)
NetC105_1: C105.1 R26.1 R35.1 ; sheet PR/R2out
NetC105_2: C105.2 R18.1 R23.1 ; sheet PR/R1out
NetIoutA1_1: IoutA1.1 R30.1 U5.20(I_OUTA)
NetIoutB1_1: IoutB1.1 R22.2 U5.19(I_OUTB)
NetR20_2: R20.2 R93.2 U5.16(I_REFIN)

Not connected (* = marked no-connect by the designer): U7 7(NC)

### Channels
W12/DACNulCarA/N: designators AmpN1=AmpN1B AmpP1=AmpP1B C36=C36B C37=C37B C38=C38B C39=C39B C40=C40B C41=C41B C42=C42B C43=C43B C44=C44B C45=C45B C46=C46B C47=C47B C48=C48B C49=C49B C50=C50B C80=C80B C83=C83B C96=C96B C97=C97B C98=C98B C105=C105A IoutA1=IoutA1B IoutB1=IoutB1B R18=R18B R19=R19B R20=R20B R22=R22B R23=R23B R24=R24B R26=R26B R29=R29B R30=R30B R33=R33B R34=R34B R35=R35B R93=R93A U5=U5B U6=U6B U7=U7B; ports FastDacClk=NullerClk_DACNulCarA Vdd=Vdd Vref=Vref Vss=Vss
W12/DACNulCarA/C: designators AmpN1=AmpN1A AmpP1=AmpP1A C36=C36A C37=C37A C38=C38A C39=C39A C40=C40A C41=C41A C42=C42A C43=C43A C44=C44A C45=C45A C46=C46A C47=C47A C48=C48A C49=C49A C50=C50A C80=C80A C83=C83A C96=C96A C97=C97A C98=C98A C105=C105B IoutA1=IoutA1A IoutB1=IoutB1A R18=R18A R19=R19A R20=R20A R22=R22A R23=R23A R24=R24A R26=R26A R29=R29A R30=R30A R33=R33A R34=R34A R35=R35A R93=R93B U5=U5A U6=U6A U7=U7A; ports FastDacClk=CarrierClk_DACNulCarA Vdd=Vdd Vref=Vref Vss=Vss
W12/DACNulCarB/N: designators AmpN1=AmpN1D AmpP1=AmpP1D C36=C36D C37=C37D C38=C38D C39=C39D C40=C40D C41=C41D C42=C42D C43=C43D C44=C44D C45=C45D C46=C46D C47=C47D C48=C48D C49=C49D C50=C50D C80=C80D C83=C83D C96=C96D C97=C97D C98=C98D C105=C105C IoutA1=IoutA1D IoutB1=IoutB1D R18=R18D R19=R19D R20=R20D R22=R22D R23=R23D R24=R24D R26=R26D R29=R29D R30=R30D R33=R33D R34=R34D R35=R35D R93=R93C U5=U5D U6=U6D U7=U7D; ports FastDacClk=NullerClk_DACNulCarB Vdd=Vdd Vref=Vref Vss=Vss
W12/DACNulCarB/C: designators AmpN1=AmpN1C AmpP1=AmpP1C C36=C36C C37=C37C C38=C38C C39=C39C C40=C40C C41=C41C C42=C42C C43=C43C C44=C44C C45=C45C C46=C46C C47=C47C C48=C48C C49=C49C C50=C50C C80=C80C C83=C83C C96=C96C C97=C97C C98=C98C C105=C105D IoutA1=IoutA1C IoutB1=IoutB1C R18=R18C R19=R19C R20=R20C R22=R22C R23=R23C R24=R24C R26=R26C R29=R29C R30=R30C R33=R33C R34=R34C R35=R35C R93=R93D U5=U5C U6=U6C U7=U7C; ports FastDacClk=CarrierClk_DACNulCarB Vdd=Vdd Vref=Vref Vss=Vss
W34/DACNulCarA/N: designators AmpN1=AmpN1F AmpP1=AmpP1F C36=C36F C37=C37F C38=C38F C39=C39F C40=C40F C41=C41F C42=C42F C43=C43F C44=C44F C45=C45F C46=C46F C47=C47F C48=C48F C49=C49F C50=C50F C80=C80F C83=C83F C96=C96F C97=C97F C98=C98F C105=C105E IoutA1=IoutA1F IoutB1=IoutB1F R18=R18F R19=R19F R20=R20F R22=R22F R23=R23F R24=R24F R26=R26F R29=R29F R30=R30F R33=R33F R34=R34F R35=R35F R93=R93E U5=U5F U6=U6F U7=U7F; ports FastDacClk=NullerClk_DACNulCarA Vdd=Vdd Vref=Vref Vss=Vss
W34/DACNulCarA/C: designators AmpN1=AmpN1E AmpP1=AmpP1E C36=C36E C37=C37E C38=C38E C39=C39E C40=C40E C41=C41E C42=C42E C43=C43E C44=C44E C45=C45E C46=C46E C47=C47E C48=C48E C49=C49E C50=C50E C80=C80E C83=C83E C96=C96E C97=C97E C98=C98E C105=C105F IoutA1=IoutA1E IoutB1=IoutB1E R18=R18E R19=R19E R20=R20E R22=R22E R23=R23E R24=R24E R26=R26E R29=R29E R30=R30E R33=R33E R34=R34E R35=R35E R93=R93F U5=U5E U6=U6E U7=U7E; ports FastDacClk=CarrierClk_DACNulCarA Vdd=Vdd Vref=Vref Vss=Vss
W34/DACNulCarB/N: designators AmpN1=AmpN1H AmpP1=AmpP1H C36=C36H C37=C37H C38=C38H C39=C39H C40=C40H C41=C41H C42=C42H C43=C43H C44=C44H C45=C45H C46=C46H C47=C47H C48=C48H C49=C49H C50=C50H C80=C80H C83=C83H C96=C96H C97=C97H C98=C98H C105=C105G IoutA1=IoutA1H IoutB1=IoutB1H R18=R18H R19=R19H R20=R20H R22=R22H R23=R23H R24=R24H R26=R26H R29=R29H R30=R30H R33=R33H R34=R34H R35=R35H R93=R93G U5=U5H U6=U6H U7=U7H; ports FastDacClk=NullerClk_DACNulCarB Vdd=Vdd Vref=Vref Vss=Vss
W34/DACNulCarB/C: designators AmpN1=AmpN1G AmpP1=AmpP1G C36=C36G C37=C37G C38=C38G C39=C39G C40=C40G C41=C41G C42=C42G C43=C43G C44=C44G C45=C45G C46=C46G C47=C47G C48=C48G C49=C49G C50=C50G C80=C80G C83=C83G C96=C96G C97=C97G C98=C98G C105=C105H IoutA1=IoutA1G IoutB1=IoutB1G R18=R18G R19=R19G R20=R20G R22=R22G R23=R23G R24=R24G R26=R26G R29=R29G R30=R30G R33=R33G R34=R34G R35=R35G R93=R93H U5=U5G U6=U6G U7=U7G; ports FastDacClk=CarrierClk_DACNulCarB Vdd=Vdd Vref=Vref Vss=Vss

### Buses and harness runs
bus DACdata[0..15]
bus DACdata[0..15] = port DACdata[0..15]
harness SwitchCtrl = port SwitchCtrl
harness SwitchCtrl = sheet PR/SwitchCtrl

### Layout directives
differential pair: NO.DACout_N, NO.DACout_P

### Notes on the sheet
- The LADCOM input current = 2.75x Iref. See Figure 10 P.8 of AD768 data sheet.
- Power Input
- (near C37) The LADCOM input current to Vss = 0.32*IoutFS = 0.32*8*IrefIn = 2.56*IrefIn
- (near C42) C42/C38 can be used to further reduce bandwidth
  -3dB lower at 26kHz and 12.5Mhz
- (near U5) DAC noise is typically 50pA/sqrt(Hz)
- (near R35) Active low pass filter
  See data sheet
  http://www.ti.com/lit/an/sloa054d/sloa054d.pdf
- Resistance range
  62 Ohms to 1k
- (near C38) For IoutFS=10mA we need 1.25mA Irefin
- (near C43) LT6201 is 0.95nV/sqrt(Hz)
  40mA Total supply current (20mA x 2)
  Estimate output voltage range +4.5V - > +0.5V (8Vp-p)
  8Vp-p*30mOhms/120Ohms = 2mVp-p
  The LT6231 is pin compatible - uses way less current than LT6201 and seems to perform better in every way except for swing
  The ADA4898-2 is also compatible
- The  DAC has 0.8 Vinl and 2.4V Vinh digital voltage thresholds
- For IoutFS=10mA, the DAC requires:
  5mA on5V
  40mA on -5V
  The LT6201 requires max 23mA per amp
  The THS4131 requires 40mA total blast mode
- Total current:
  +5V  => 68mA
  -5V   => 103mA
- (near C43) Modifications:
  Replace LT6201 with LT6231 - save a lot of power this way at no cost
  LT6231 was used on the previous mezzanine board as the first stage amp
  Reduce first stage gain resitors to 383 instead of 453. Will not saturate first stage then when using full range on DAC.
  Variable resistor should be between 125Ohm and 1250 Ohm instead of 62 and 1k
  Should use AD8139 as last stage amp - different package though - uses double power but can deliver significantly more current to load. Can keep original amplifier but need to increase 10Ohms to 70 Ohms to ensure last stage does not saturate. We lose dynamic range then though. If we use the THS4131 need to reduce feedback to 200 Ohms, with AD8139 use 226.
  Would actually reccomend nuller have THS4131 since it does not require the current drive
- File:
- Size:
- Date:
- Letter
- Revision:
- Sheet
- of
- Cosmology
- Drawn by:
- (in symbol LTC1668IG  DAC) 16bit DAC, 50MSPS, 180mW

### Library data of the parts
AmpN1 AmpP1 IoutA1 IoutB1 = TestPoint: TestPoint1; Assembly Comments: none; Footprint: *
C36 C37 C40 C44 C46 C48 C50 C80 C97 = CAP 0603: as C51 on sheet NullerCarrier; Value: 0.1uF, 0402; Supplier 1: Digi-Key; Supplier Part Number 1: 445-1265-1-ND; Operating Temperature: -55°C ~ 85°C; Thickness (Max): 0.022" (0.55mm); Packaging: Cut Tape (CT)
C38 C39 C41 C42 C105 = CAP 0402: Capacitor, Ceramic, 0402; Part Constraints: 10% 16V X7R 0402; Manufacturer: Generic; Assembly Comments: none; Manufacturer Part Number 1: Generic
  C38 C39 C41 C42: Value: 12pF, 0402
  C105: Value: DNL
C43 C45 C47 C49 C83 C96 C98 = CAP 0805: as C53 on sheet NullerCarrier; Supplier 1: Digi-Key; Supplier Part Number 1: 587-1297-6-ND; Packaging: Digi-Reel®; Operating Temperature: -55°C ~ 85°C; Thickness (Max): 0.037" (0.95mm); Part Constraints: LMK212BJ475KD-T
  C43 C45 C47 C49 C83 C96: Value: 4.7uF, 10V
  C98: Value: DNL
R18 R19 R22-R24 R26 R29 R30 R33-R35 = RES 0402: as R27 on sheet NullerCarrier; Manufacturer Part Number 1: Generic
  R18 R23 R26 R35: Value: 249
  R19 R33: Value: 453
  R22 R30: Value: 0
  R24 R29: Value: 10
  R34: Value: DNL
R20 = RES 0402: Resistor; Manufacturer: Susumu; Part Constraints: 2k, 0.5%, 25ppm. 0402; Assembly Comments: none; Temperature Coefficient: ±25ppm/°C; Value: 2k, 0.5%, 25ppm; Supplier 1: Digi-Key; Supplier Part Number 1: RG10P2.00KDCT-ND; Packaging: Cut Tape (CT)
R93 = RES 0402: Resistor; Manufacturer: Susumu; Part Constraints: 2k, 0.5%, 25ppm. 0402; Manufacturer Part Number 1: RG1005P-202-D-T10; Assembly Comments: none; Temperature Coefficient: ±25ppm/°C; Value: DNL; Supplier 1: Digi-Key; Supplier Part Number 1: RG10P2.00KDCT-ND; Packaging: Cut Tape (CT)
U5 = LTC1668IG  DAC: IC DAC 16BIT 50MSPS 28SSOP; Manufacturer: Linear Technology; Assembly Comments: none; Supplier 1: Digi-Key; Manufacturer Part Number 1: LTC1668IG; Operating Temperature: -40°C ~ 85°C; Packaging: Tube; Supplier Part Number 1: LTC1668IG-ND; Part Constraints: LTC1668IG
U6 = LT6201: Dual R-R Opamp Soic 8 165Mhz GBP; Part Constraints: LT6201CS8#PBF; Manufacturer: Linear Technology; Assembly Comments: none; Supplier 1: Digi-Key; Supplier Part Number 1: LT6201CS8#PBF-ND; Manufacturer Part Number 1: LT6201CS8#PBF
U7 = THS4131IDGNR: IC OPAMP DIFF 225MHZ SGL 8MSOP; Manufacturer: Texas Instruments; Assembly Comments: none; Supplier 1: Digi-Key; Manufacturer Part Number 1: THS4131IDGNR; Operating Temperature: -40°C ~ 85°C; Packaging: Cut Tape (CT); Supplier Part Number 1: 296-10047-1-ND; Part Constraints: THS4131IDGNR

## Sheet ProgramableResistor.SchDoc
size Letter; Author: Adam Gilbert; CompanyName: McGill University; DrawnBy: Adam Gilbert; Organization: Altium Limited; Address1: McGill Cosmology; Address2: 3600 University Street; Address3: Montreal, Quebec; Address4: Canada; DocumentNumber: 8; Revision: Rev2; SheetNumber: 8; SheetTotal: 16; ProjectTitle: DfMux FMC Mezz; ModelNumber: MGMEZZ04; ProjectName: DfMux FMC Mezz
Used 8 times, as channels W12/DACNulCarA/N/PR, W12/DACNulCarA/C/PR, W12/DACNulCarB/N/PR, W12/DACNulCarB/C/PR, W34/DACNulCarA/N/PR, W34/DACNulCarA/C/PR, W34/DACNulCarB/N/PR, W34/DACNulCarB/C/PR. Parts and nets are listed once, with the designators drawn on the sheet.
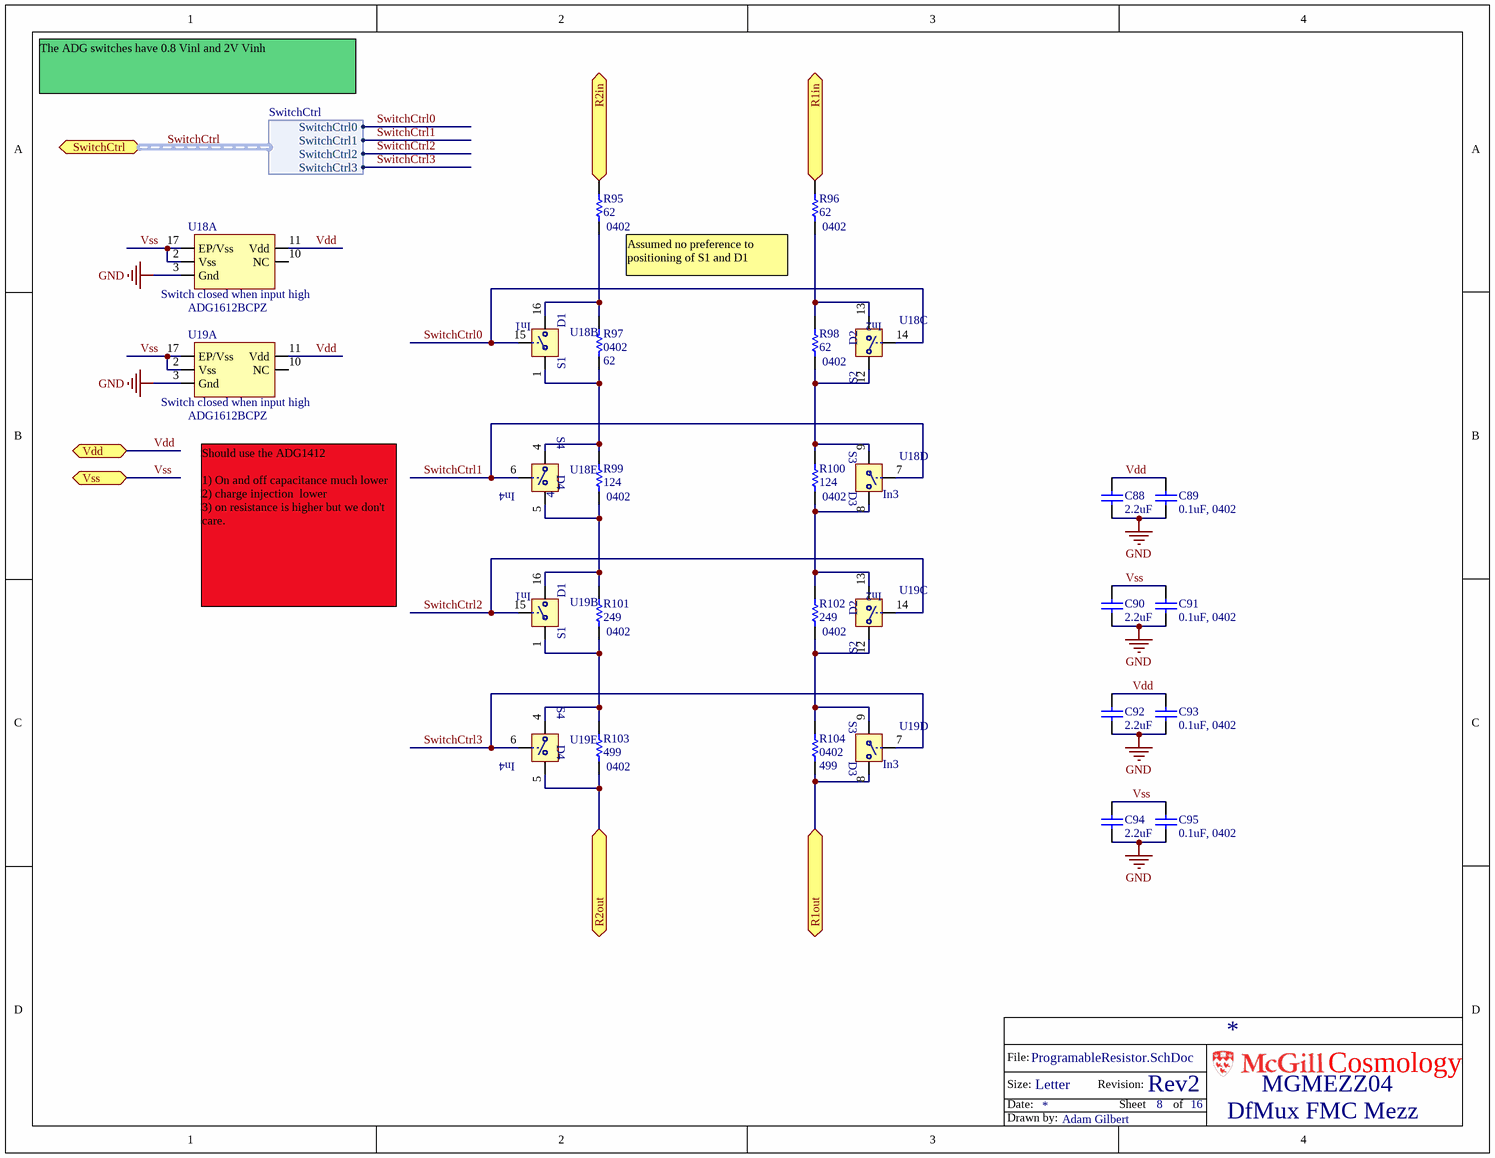
[diagram p10: ProgramableResistor.SchDoc]

### Parts
C88  2.2uF  [0603]
C89  0.1uF, 0402  [0402]
C90  2.2uF  [0603]
C91  0.1uF, 0402  [0402]
C92  2.2uF  [0603]
C93  0.1uF, 0402  [0402]
C94  2.2uF  [0603]
C95  0.1uF, 0402  [0402]
R95  62  [0402]
R96  62  [0402]
R97  62  [0402]
R98  62  [0402]
R99  124  [0402]
R100  124  [0402]
R101  249  [0402]
R102  249  [0402]
R103  499  [0402]
R104  499  [0402]
U18  ADG1612BCPZ  [QFN127P600-8N]  (parts A,B,C,D,E of 5)
U19  ADG1612BCPZ  [QFN127P600-8N]  (parts A,B,C,D,E of 5)

### Ports
R1in, R1out, R2in, R2out, SwitchCtrl (harness SwitchCtrl), Vdd, Vss

### Harnesses
SwitchCtrl: SwitchCtrl0, SwitchCtrl1, SwitchCtrl2, SwitchCtrl3

### Nets
GND: C88.2 C89.1 C90.2 C91.1 C92.2 C93.1 C94.2 C95.1 U18.3(Gnd) U19.3(Gnd)
R1in: R96.2 ; port R1in
R1out: R104.2 U19.8(D3) ; port R1out
R2in: R95.2 ; port R2in
R2out: R103.1 U19.5(D4) ; port R2out
SwitchCtrl0: U18.14(In2) U18.15(In1) ; port SwitchCtrl.SwitchCtrl0  [project net SwitchCtrl.SwitchCtrl0]
SwitchCtrl1: U18.6(In4) U18.7(In3) ; port SwitchCtrl.SwitchCtrl1  [project net SwitchCtrl.SwitchCtrl1]
SwitchCtrl2: U19.14(In2) U19.15(In1) ; port SwitchCtrl.SwitchCtrl2  [project net SwitchCtrl.SwitchCtrl2]
SwitchCtrl3: U19.6(In4) U19.7(In3) ; port SwitchCtrl.SwitchCtrl3  [project net SwitchCtrl.SwitchCtrl3]
Vdd: C88.1 C89.2 C92.1 C93.2 U18.11(Vdd) U19.11(Vdd) ; port Vdd
Vss: C90.1 C91.2 C94.1 C95.2 U18.2(Vss) U18.17(EP/Vss) U19.2(Vss) U19.17(EP/Vss) ; port Vss
NetR95_1: R95.1 R97.1 U18.16(D1)
NetR96_1: R96.1 R98.2 U18.13(D2)
NetR97_2: R97.2 R99.2 U18.1(S1) U18.4(S4)
NetR98_1: R98.1 R100.2 U18.9(S3) U18.12(S2)
NetR99_1: R99.1 R101.2 U18.5(D4) U19.16(D1)
NetR100_1: R100.1 R102.2 U18.8(D3) U19.13(D2)
NetR101_1: R101.1 R103.2 U19.1(S1) U19.4(S4)
NetR102_1: R102.1 R104.1 U19.9(S3) U19.12(S2)

Not connected (* = marked no-connect by the designer): U18 10(NC); U19 10(NC)

### Channels
W12/DACNulCarA/N/PR: designators end in B; ports R1in=NetAmpP1B_1 R1out=NetC105A_2 R2in=NetAmpN1B_1 R2out=NetC105A_1 Vdd=Vdd Vss=Vss
W12/DACNulCarA/C/PR: designators end in A; ports R1in=NetAmpP1A_1 R1out=NetC105B_2 R2in=NetAmpN1A_1 R2out=NetC105B_1 Vdd=Vdd Vss=Vss
W12/DACNulCarB/N/PR: designators end in D; ports R1in=NetAmpP1D_1 R1out=NetC105C_2 R2in=NetAmpN1D_1 R2out=NetC105C_1 Vdd=Vdd Vss=Vss
W12/DACNulCarB/C/PR: designators end in C; ports R1in=NetAmpP1C_1 R1out=NetC105D_2 R2in=NetAmpN1C_1 R2out=NetC105D_1 Vdd=Vdd Vss=Vss
W34/DACNulCarA/N/PR: designators end in F; ports R1in=NetAmpP1F_1 R1out=NetC105E_2 R2in=NetAmpN1F_1 R2out=NetC105E_1 Vdd=Vdd Vss=Vss
W34/DACNulCarA/C/PR: designators end in E; ports R1in=NetAmpP1E_1 R1out=NetC105F_2 R2in=NetAmpN1E_1 R2out=NetC105F_1 Vdd=Vdd Vss=Vss
W34/DACNulCarB/N/PR: designators end in H; ports R1in=NetAmpP1H_1 R1out=NetC105G_2 R2in=NetAmpN1H_1 R2out=NetC105G_1 Vdd=Vdd Vss=Vss
W34/DACNulCarB/C/PR: designators end in G; ports R1in=NetAmpP1G_1 R1out=NetC105H_2 R2in=NetAmpN1G_1 R2out=NetC105H_1 Vdd=Vdd Vss=Vss

### Buses and harness runs
harness SwitchCtrl = port SwitchCtrl

### Notes on the sheet
- The ADG switches have 0.8 Vinl and 2V Vinh
- Assumed no preference to positioning of S1 and D1
- (near U18) 4
- Should use the ADG1412
  1) On and off capacitance much lower
  2) charge injection  lower
  3) on resistance is higher but we don't care.
- File:
- Size:
- Date:
- Letter
- Revision:
- Sheet
- of
- Cosmology
- Drawn by:
- (in symbol ADG1612BCPZ, part A) Switch closed when input high

### Library data of the parts
C88 C90 C92 C94 = CAP 0603: as C77 on sheet NullerCarrier; Value: 2.2uF; Supplier 1: Digi-Key; Supplier Part Number 1: 445-5175-1-ND; Operating Temperature: -55°C ~ 85°C; Thickness (Max): 0.037" (0.95mm); Packaging: Cut Tape (CT)
C89 C91 C93 C95 = CAP 0603: as C51 on sheet NullerCarrier; Value: 0.1uF, 0402; Supplier 1: Digi-Key; Supplier Part Number 1: 445-1265-1-ND; Operating Temperature: -55°C ~ 85°C; Thickness (Max): 0.022" (0.55mm); Packaging: Cut Tape (CT)
R95-R104 = RES 0402: as R27 on sheet NullerCarrier; Manufacturer Part Number 1: Generic
  R95-R98: Value: 62
  R99 R100: Value: 124
  R101 R102: Value: 249
  R103 R104: Value: 499
U18 U19 = ADG1612BCPZ: Switch 4 SPST-NO - VQFN package; Manufacturer Part Number 1: ADG1612BCPZ-REEL7; Manufacturer: Analog Devices Inc; Assembly Comments: none; Supplier 1: Digi-Key; Operating Temperature: -40°C ~ 125°C; Packaging: Cut Tape (CT); Supplier Part Number 1: ADG1612BCPZ-REEL7CT-ND; Part Constraints: ADG1612BCPZ-REEL7

## Sheet LvlTranslate.SchDoc
size Letter; Author: Adam Gilbert; CompanyName: McGill University; DrawnBy: Adam Gilbert; Organization: Altium Limited; Address1: McGill Cosmology; Address2: 3600 University Street; Address3: Montreal, Quebec; Address4: Canada; DocumentNumber: 9; Revision: Rev2; SheetNumber: 9; SheetTotal: 16; ProjectTitle: DfMux FMC Mezz; ModelNumber: MGMEZZ04; ProjectName: DfMux FMC Mezz
Used 4 times, as channels W12/DACNulCarA/Tr1, W12/DACNulCarB/Tr1, W34/DACNulCarA/Tr1, W34/DACNulCarB/Tr1. Parts and nets are listed once, with the designators drawn on the sheet.
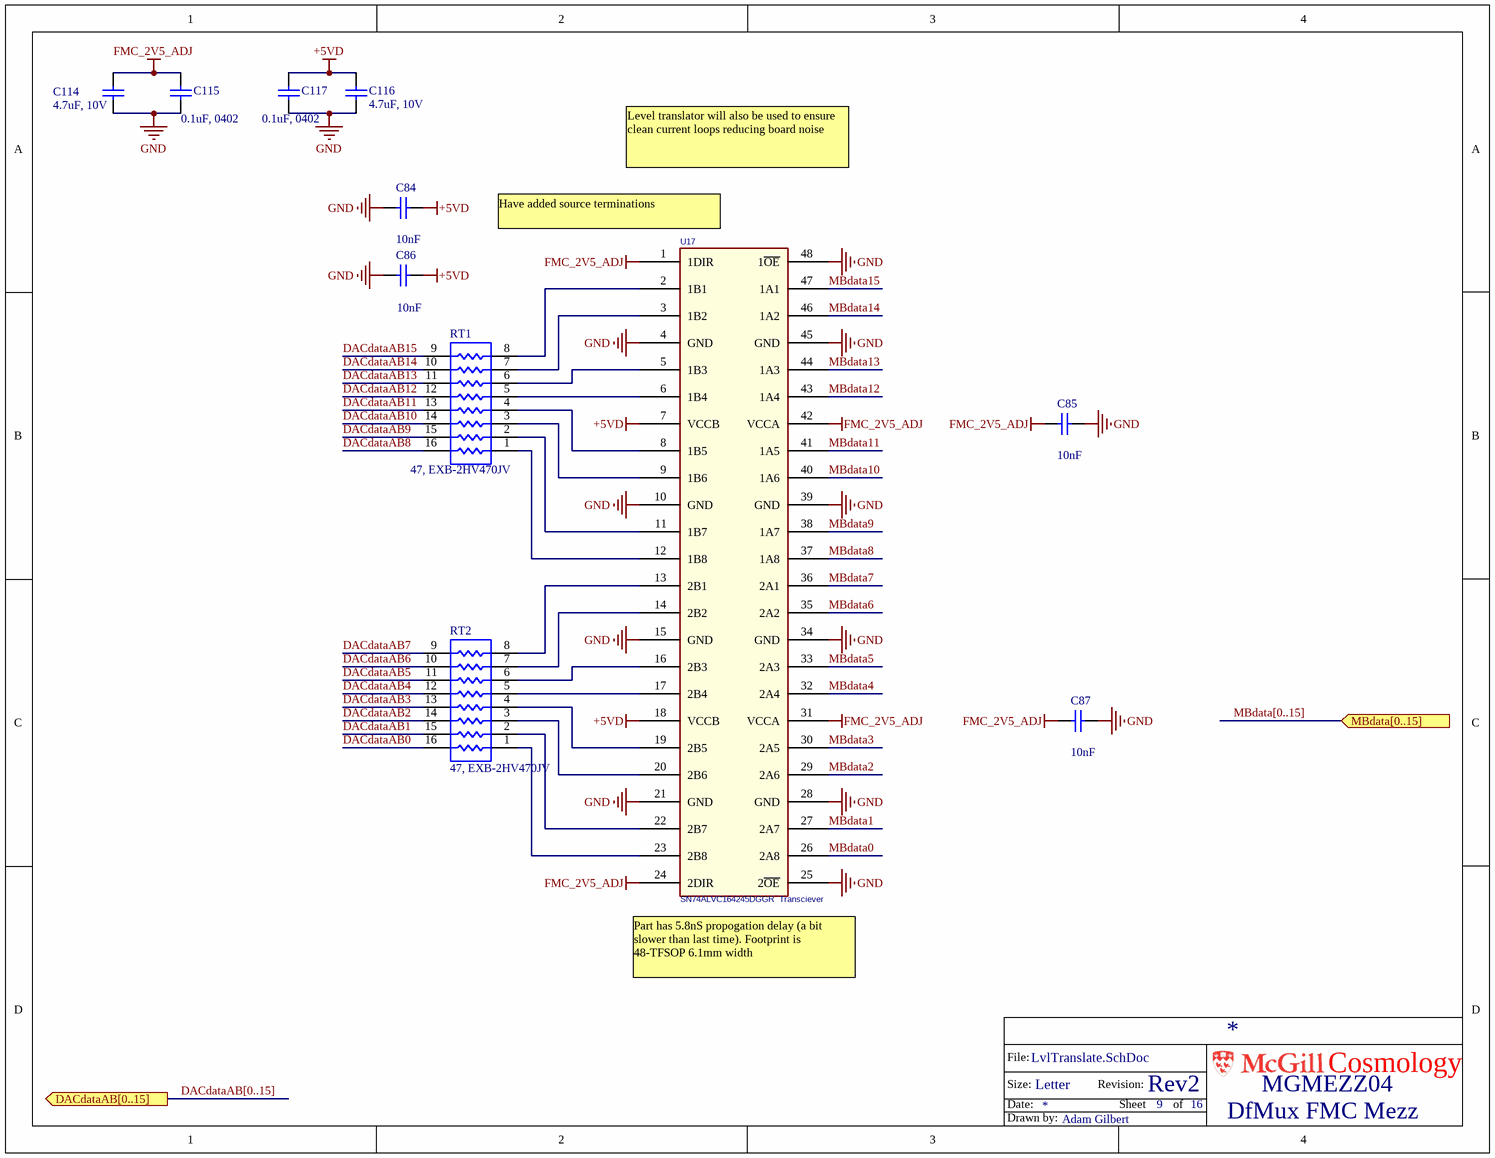
[diagram p11: LvlTranslate.SchDoc]

### Parts
C84  10nF  [0402]
C85  10nF  [0402]
C86  10nF  [0402]
C87  10nF  [0402]
C114  4.7uF, 10V  [0805]
C115  0.1uF, 0402  [0402]
C116  4.7uF, 10V  [0805]
C117  0.1uF, 0402  [0402]
RT1  47, EXB-2HV470JV  [0402_Array_2HV]
RT2  47, EXB-2HV470JV  [0402_Array_2HV]
U17  SN74ALVC164245DGGR  Transciever  [TSSOP48-0.5mmpitch]

### Ports
DACdataAB[0..15] (out), MBdata[0..15] (in)

### Nets
+5VD: C84.2 C86.2 C116.2 C117.2 U17.7(VCCB) U17.18(VCCB)
FMC_2V5_ADJ: C85.1 C87.1 C114.2 C115.2 U17.1(1DIR) U17.24(2DIR) U17.31(VCCA) U17.42(VCCA)
GND: C84.1 C85.2 C86.1 C87.2 C114.1 C115.1 C116.1 C117.1 U17.4(GND) U17.10(GND) U17.15(GND) U17.21(GND) U17.25(2~{OE}) U17.28(GND) U17.34(GND) U17.39(GND) U17.45(GND) U17.48(1~{OE})
DACdataAB0: RT2.16
DACdataAB1: RT2.15
DACdataAB2: RT2.14
DACdataAB3: RT2.13
DACdataAB4: RT2.12
DACdataAB5: RT2.11
DACdataAB6: RT2.10
DACdataAB7: RT2.9
DACdataAB8: RT1.16
DACdataAB9: RT1.15
DACdataAB10: RT1.14
DACdataAB11: RT1.13
DACdataAB12: RT1.12
DACdataAB13: RT1.11
DACdataAB14: RT1.10
DACdataAB15: RT1.9
MBdata0: U17.26(2A8)
MBdata1: U17.27(2A7)
MBdata2: U17.29(2A6)
MBdata3: U17.30(2A5)
MBdata4: U17.32(2A4)
MBdata5: U17.33(2A3)
MBdata6: U17.35(2A2)
MBdata7: U17.36(2A1)
MBdata8: U17.37(1A8)
MBdata9: U17.38(1A7)
MBdata10: U17.40(1A6)
MBdata11: U17.41(1A5)
MBdata12: U17.43(1A4)
MBdata13: U17.44(1A3)
MBdata14: U17.46(1A2)
MBdata15: U17.47(1A1)
NetRT1_1: RT1.1 U17.12(1B8)
NetRT1_2: RT1.2 U17.11(1B7)
NetRT1_3: RT1.3 U17.9(1B6)
NetRT1_4: RT1.4 U17.8(1B5)
NetRT1_5: RT1.5 U17.6(1B4)
NetRT1_6: RT1.6 U17.5(1B3)
NetRT1_7: RT1.7 U17.3(1B2)
NetRT1_8: RT1.8 U17.2(1B1)
NetRT2_1: RT2.1 U17.23(2B8)
NetRT2_2: RT2.2 U17.22(2B7)
NetRT2_3: RT2.3 U17.20(2B6)
NetRT2_4: RT2.4 U17.19(2B5)
NetRT2_5: RT2.5 U17.17(2B4)
NetRT2_6: RT2.6 U17.16(2B3)
NetRT2_7: RT2.7 U17.14(2B2)
NetRT2_8: RT2.8 U17.13(2B1)

### Channels
W12/DACNulCarA/Tr1: designators end in A
W12/DACNulCarB/Tr1: designators end in B
W34/DACNulCarA/Tr1: designators end in C
W34/DACNulCarB/Tr1: designators end in D

### Buses and harness runs
bus DACdataAB[0..15] = port DACdataAB[0..15]
bus MBdata[0..15] = port MBdata[0..15]

### Notes on the sheet
- Level translator will also be used to ensure clean current loops reducing board noise
- (near U17) Have added source terminations
- (near U17) Part has 5.8nS propogation delay (a bit slower than last time). Footprint is 48-TFSOP 6.1mm width
- File:
- Size:
- Date:
- Letter
- Revision:
- Sheet
- of
- Cosmology
- Drawn by:

### Library data of the parts
C84-C87 = CAP 0402: Capacitor, Ceramic, 0402; Part Constraints: 10% 16V X7R 0402; Manufacturer Part Number 1: GRM15XR71C103KA86D; Manufacturer: Murata Electronics North America; Assembly Comments: none; Temperature Coefficient: X7R; Supplier 1: Digi-Key; Operating Temperature: -55°C ~ 125°C; Thickness (Max): 0.012" (0.30mm); Packaging: Cut Tape (CT); Supplier Part Number 1: 490-6370-1-ND; Value: 10nF
C114 C116 = CAP 0805: as C53 on sheet NullerCarrier; Supplier 1: Digi-Key; Supplier Part Number 1: 587-1297-6-ND; Packaging: Digi-Reel®; Operating Temperature: -55°C ~ 85°C; Thickness (Max): 0.037" (0.95mm); Value: 4.7uF, 10V; Part Constraints: LMK212BJ475KD-T
C115 C117 = CAP 0603: as C51 on sheet NullerCarrier; Value: 0.1uF, 0402; Supplier 1: Digi-Key; Supplier Part Number 1: 445-1265-1-ND; Operating Temperature: -55°C ~ 85°C; Thickness (Max): 0.022" (0.55mm); Packaging: Cut Tape (CT)
RT1 RT2 = Res_Pack: RES ARRAY 47 OHM SMD; Manufacturer: Panasonic - ECG; Assembly Comments: none; Part constraints: EXB-2HV470JV; Manufacturer Part Number 1: EXB-2HV470JV; Supplier 1: Digikey; Supplier Part Number 1: Y1470CT-ND
U17 = SN74ALVC164245DGGR Transciever: Manufacturer: Texas Instruments; Assembly Comments: none; Manufacturer Part Number 1: SN74ALVC164245DGGR; Part Constraints: SN74ALVC164245DGGR; Operating Temperature: -40°C ~ 85°C; Packaging: Cut Tape (CT); Supplier 1: Digi-Key; Supplier Part Number 1: 296-1135-1-ND